# Altium schematic sheet 温湿度.SchDoc
size A2
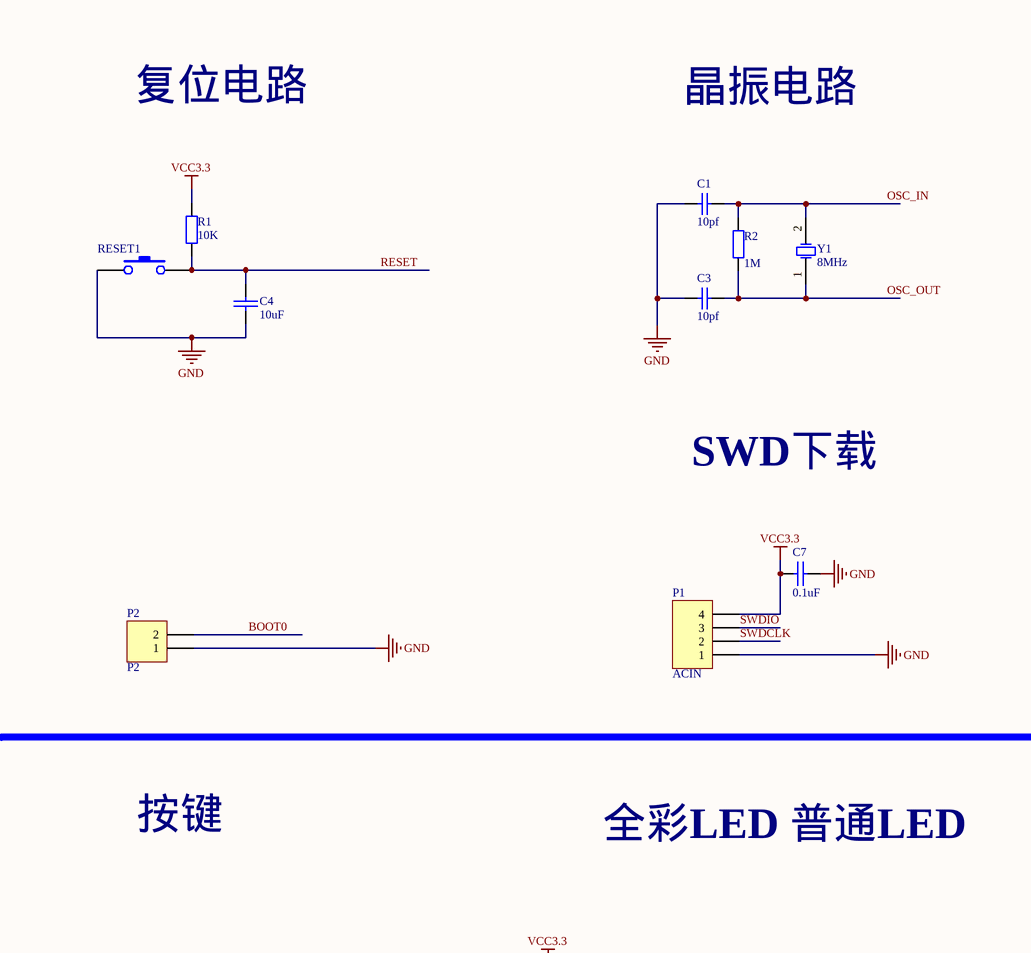
[diagram p0: 温湿度.SchDoc, top left]
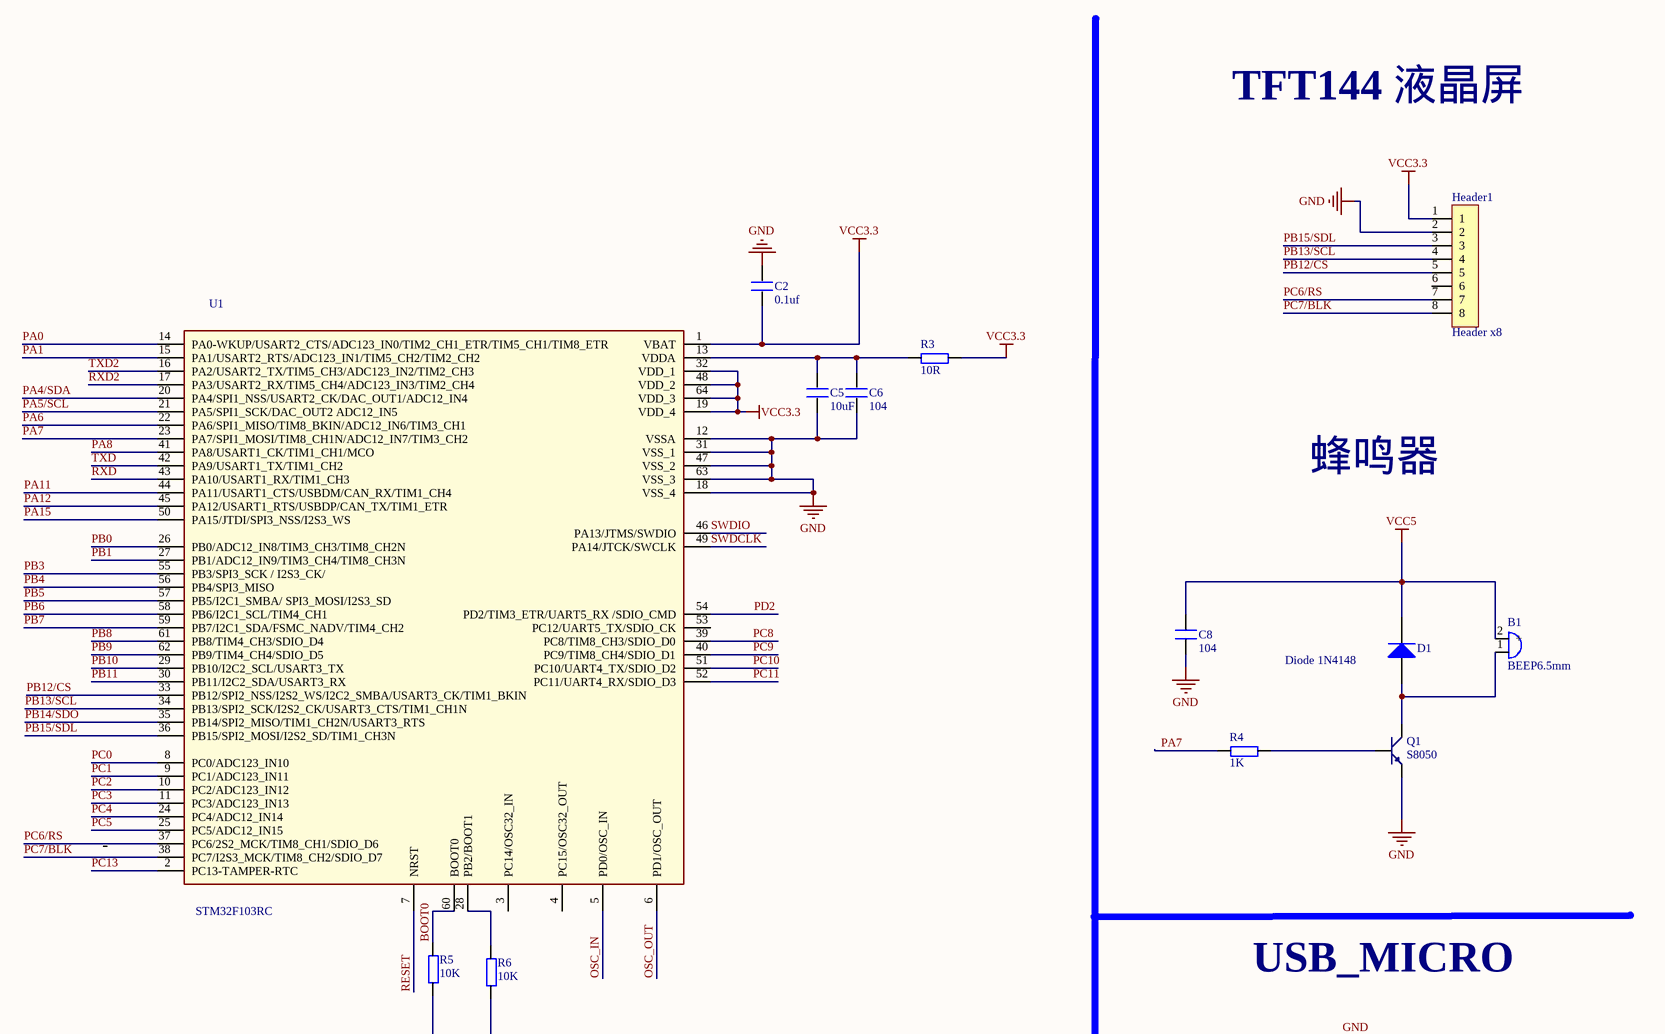
[diagram p1: 温湿度.SchDoc, top right]
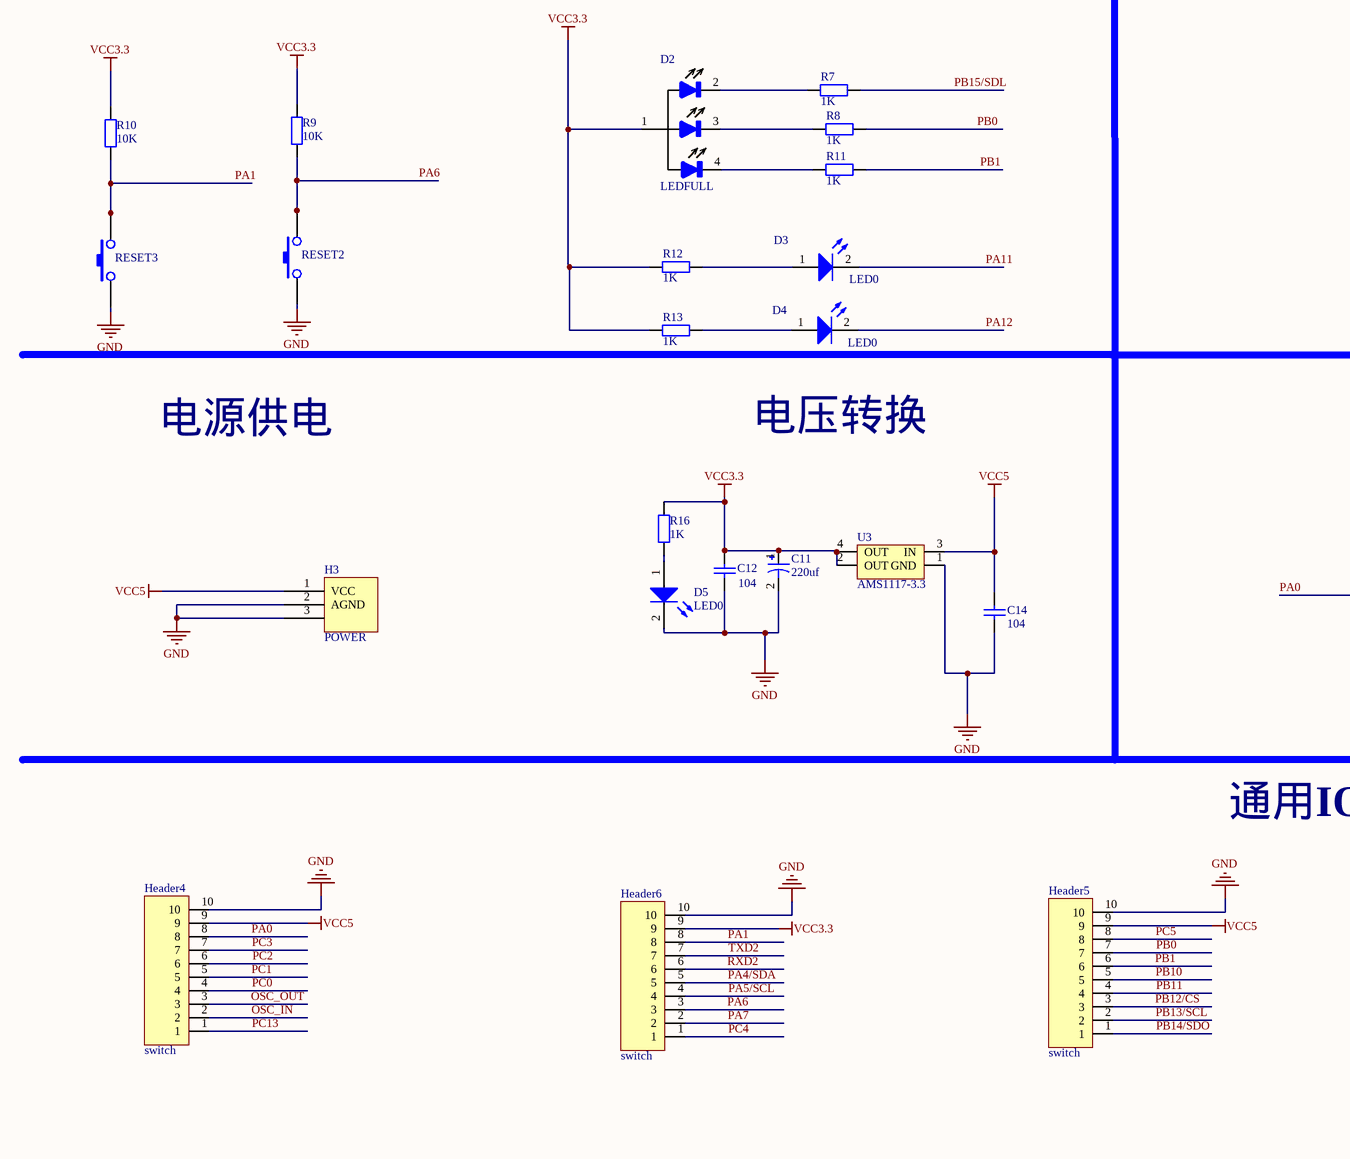
[diagram p2: 温湿度.SchDoc, bottom left]
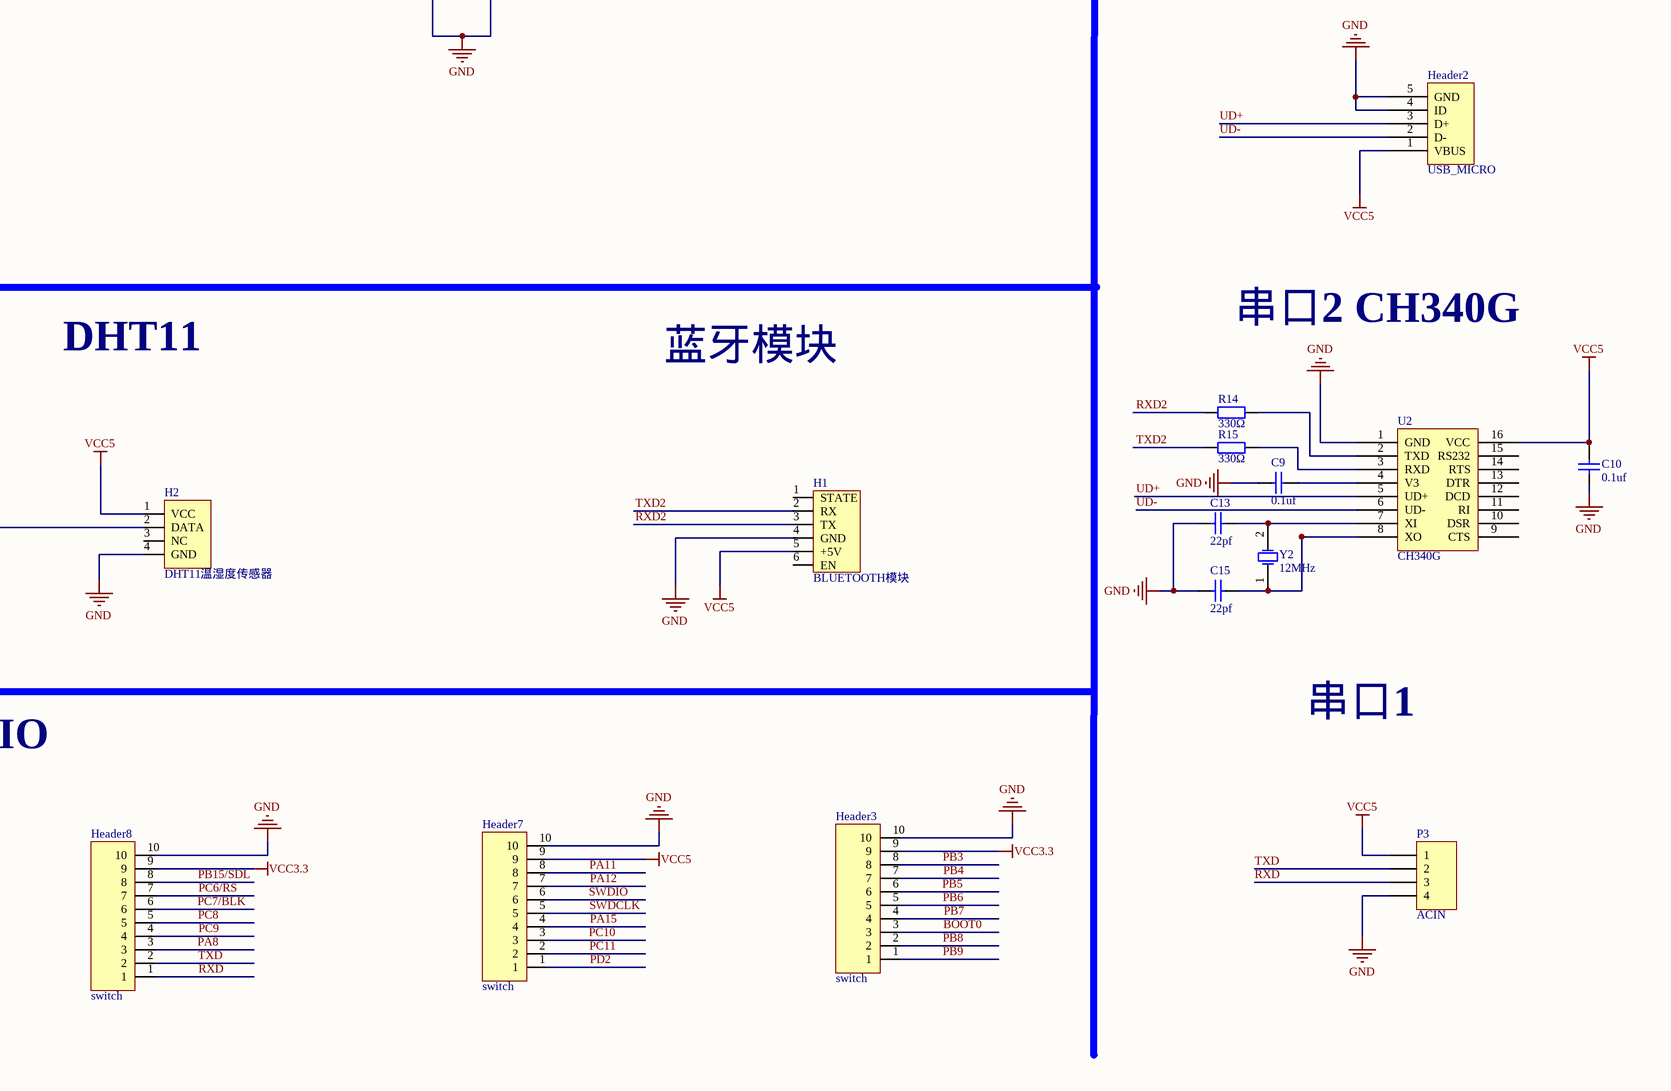
[diagram p3: 温湿度.SchDoc, bottom right]

## Parts
B1  BEEP6.5mm  [BEEP 6.5x12x6]
C1  10pf  [0805C]
C2  0.1uf  [0805C]
C3  10pf  [0805C]
C4  10uF  [0805C]
C5  10uF  [0805C]
C6  104  [0805C]
C7  0.1uF  [0805C]
C8  104  [0805C]
C9  0.1uf  [0805C]
C10  0.1uf  [0805C]
C11  220uf  [HDR2.54-LI-2P]
C12  104  [0805C]
C13  22pf  [0805C]
C14  104  [0805C]
C15  22pf  [0805C]
D1  Diode 1N4148  [0805D]
D2  LEDFULL  [LEDFULL]
D3  LED0  [LED_0805_B]
D4  LED0  [LED_0805_B]
D5  LED0  [LED_0805_B]
H1  BLUETOOTH模块  [BLUETOOTH]
H2  DHT11温湿度传感器  [DHT11]
H3  POWER  [DC-005]
Header1  Header x8  [HDR2.54-M-LI-8P]
Header2  USB_MICRO  [USB/SM0.8-6H5]
Header3  switch  [HDR2.54-LI-10P]
Header4  switch  [HDR2.54-LI-10P]
Header5  switch  [HDR2.54-LI-10P]
Header6  switch  [HDR2.54-LI-10P]
Header7  switch  [HDR2.54-LI-10P]
Header8  switch  [HDR2.54-LI-10P]
P1  ACIN  [HDR2.54-LI-4P]
P2  P2  [HDR2.54-LI-2P]
P3  ACIN  [HDR2.54-LI-4P]
Q1  S8050  [SOT-23R]
R1  10K  [0805R]
R2  value 1M  [0805R]  (hidden comment: Res2)
R3  10R  [0805R]
R4  1K  [0805R]
R5  10K  [0805R]
R6  10K  [0805R]
R7  1K  [0805R]
R8  1K  [0805R]
R9  10K  [0805R]
R10  10K  [0805R]
R11  1K  [0805R]
R12  1K  [0805R]
R13  1K  [0805R]
R14  330Ω  [0805R]
R15  330Ω  [0805R]
R16  1K  [0805R]
RESET1  RESET  [QKEY]  (value not drawn)
RESET2  RESET  [QKEY]  (value not drawn)
RESET3  RESET  [QKEY]  (value not drawn)
U1  STM32F103RC  [LQFP64-高密度]
U2  CH340G  [SOP16]
U3  AMS1117-3.3  [AMS1117]
Y1  8MHz  [OSC HC-49SMD]
Y2  12MHz  [OSC HC-49SMD]

## Nets
GND: C1.1 C2.2 C3.1 C4.2 C5.1 C6.1 C7.2 C8.1 C9.2 C10.1 C11.2 C12.1 C13.2 C14.1 C15.2 D5.2(K) H1.4(GND) H2.4(GND) H3.2(AGND) H3.3 Header1.2 Header2.4(ID) Header2.5(GND) Header3.10 Header4.10 Header5.10 Header6.10 Header7.10 Header8.10 P1.1 P2.1 P3.4 Q1.1(E) R5.1 R6.1 RESET1.1 RESET2.1 RESET3.1 U1.12(VSSA) U1.18(VSS_4) U1.31(VSS_1) U1.47(VSS_2) U1.63(VSS_3) U2.1(GND) U3.1(GND)
VCC3.3: C2.1 C7.1 C11.1 C12.2 D2.1 Header1.1 Header3.9 Header6.9 Header8.9 P1.4 R1.1 R3.2 R9.1 R10.1 R12.1 R13.1 R16.1 U1.1(VBAT) U1.19(VDD_4) U1.32(VDD_1) U1.48(VDD_2) U1.64(VDD_3) U3.2(OUT) U3.4(OUT)
VCC5: B1.2(+) C8.2 C10.2 C14.2 D1.2(K) H1.5(+5V) H2.1(VCC) H3.1(VCC) Header2.1(VBUS) Header4.9 Header5.9 Header7.9 P3.1 U2.16(VCC) U3.3(IN)
BOOT0: Header3.3 P2.2 R5.2 U1.60(BOOT0)
OSC_IN: C1.2 Header4.2 R2.2 U1.5(PD0/OSC_IN) Y1.2(OSC2)
OSC_OUT: C3.2 Header4.3 R2.1 U1.6(PD1/OSC_OUT) Y1.1(OSC1)
PA0: H2.2(DATA) Header4.8 U1.14(PA0-WKUP/USART2_CTS/ADC123_IN0/TIM2_CH1_ETR/TIM5_CH1/TIM8_ETR)
PA1: Header6.8 R10.2 RESET3.2 U1.15(PA1/USART2_RTS/ADC123_IN1/TIM5_CH2/TIM2_CH2)
PA4/SDA: Header6.5 U1.20(PA4/SPI1_NSS/USART2_CK/DAC_OUT1/ADC12_IN4)
PA5/SCL: Header6.4 U1.21(PA5/SPI1_SCK/DAC_OUT2_ADC12_IN5)
PA6: Header6.3 R9.2 RESET2.2 U1.22(PA6/SPI1_MISO/TIM8_BKIN/ADC12_IN6/TIM3_CH1)
PA7: Header6.2 R4.1 U1.23(PA7/SPI1_MOSI/TIM8_CH1N/ADC12_IN7/TIM3_CH2)
PA8: Header8.3 U1.41(PA8/USART1_CK/TIM1_CH1/MCO)
PA11: D3.2(K) Header7.8 U1.44(PA11/USART1_CTS/USBDM/CAN_RX/TIM1_CH4)
PA12: D4.2(K) Header7.7 U1.45(PA12/USART1_RTS/USBDP/CAN_TX/TIM1_ETR)
PA15: Header7.4 U1.50(PA15/JTDI/SPI3_NSS/I2S3_WS)
PB0: Header5.7 R8.2 U1.26(PB0/ADC12_IN8/TIM3_CH3/TIM8_CH2N)
PB1: Header5.6 R11.2 U1.27(PB1/ADC12_IN9/TIM3_CH4/TIM8_CH3N)
PB3: Header3.8 U1.55(PB3/SPI3_SCK_/_I2S3_CK/)
PB4: Header3.7 U1.56(PB4/SPI3_MISO)
PB5: Header3.6 U1.57(PB5/I2C1_SMBA/_SPI3_MOSI/I2S3_SD)
PB6: Header3.5 U1.58(PB6/I2C1_SCL/TIM4_CH1)
PB7: Header3.4 U1.59(PB7/I2C1_SDA/FSMC_NADV/TIM4_CH2)
PB8: Header3.2 U1.61(PB8/TIM4_CH3/SDIO_D4)
PB9: Header3.1 U1.62(PB9/TIM4_CH4/SDIO_D5)
PB10: Header5.5 U1.29(PB10/I2C2_SCL/USART3_TX)
PB11: Header5.4 U1.30(PB11/I2C2_SDA/USART3_RX)
PB12/CS: Header1.5 Header5.3 U1.33(PB12/SPI2_NSS/I2S2_WS/I2C2_SMBA/USART3_CK/TIM1_BKIN)
PB13/SCL: Header1.4 Header5.2 U1.34(PB13/SPI2_SCK/I2S2_CK/USART3_CTS/TIM1_CH1N)
PB14/SDO: Header5.1 U1.35(PB14/SPI2_MISO/TIM1_CH2N/USART3_RTS)
PB15/SDL: Header1.3 Header8.8 R7.2 U1.36(PB15/SPI2_MOSI/I2S2_SD/TIM1_CH3N)
PC0: Header4.4 U1.8(PC0/ADC123_IN10)
PC1: Header4.5 U1.9(PC1/ADC123_IN11)
PC2: Header4.6 U1.10(PC2/ADC123_IN12)
PC3: Header4.7 U1.11(PC3/ADC123_IN13)
PC4: Header6.1 U1.24(PC4/ADC12_IN14)
PC5: Header5.8 U1.25(PC5/ADC12_IN15)
PC6/RS: Header1.7 Header8.7 U1.37(PC6/2S2_MCK/TIM8_CH1/SDIO_D6)
PC7/BLK: Header1.8 Header8.6 U1.38(PC7/I2S3_MCK/TIM8_CH2/SDIO_D7)
PC8: Header8.5 U1.39(PC8/TIM8_CH3/SDIO_D0)
PC9: Header8.4 U1.40(PC9/TIM8_CH4/SDIO_D1)
PC10: Header7.3 U1.51(PC10/UART4_TX/SDIO_D2)
PC11: Header7.2 U1.52(PC11/UART4_RX/SDIO_D3)
PC13: Header4.1 U1.2(PC13-TAMPER-RTC)
PD2: Header7.1 U1.54(PD2/TIM3_ETR/UART5_RX_/SDIO_CMD)
RESET: C4.1 R1.2 RESET1.2 U1.7(NRST)
RXD: Header8.1 P3.3 U1.43(PA10/USART1_RX/TIM1_CH3)
RXD2: H1.3(TX) Header6.6 R14.1 U1.17(PA3/USART2_RX/TIM5_CH4/ADC123_IN3/TIM2_CH4)
SWDCLK: Header7.5 P1.2 U1.49(PA14/JTCK/SWCLK)
SWDIO: Header7.6 P1.3 U1.46(PA13/JTMS/SWDIO)
TXD: Header8.2 P3.2 U1.42(PA9/USART1_TX/TIM1_CH2)
TXD2: H1.2(RX) Header6.7 R15.1 U1.16(PA2/USART2_TX/TIM5_CH3/ADC123_IN2/TIM2_CH3)
UD+: Header2.3(D+) U2.5(UD+)
UD-: Header2.2(D-) U2.6(UD-)
NetB1_1: B1.1 D1.1(A) Q1.3(C)
NetC5_2: C5.2 C6.2 R3.1 U1.13(VDDA)
NetC9_1: C9.1 U2.4(V3)
NetC13_1: C13.1 U2.7(XI) Y2.2(OSC2)
NetC15_1: C15.1 U2.8(XO) Y2.1(OSC1)
NetD2_2: D2.2 R7.1
NetD2_3: D2.3 R8.1
NetD2_4: D2.4 R11.1
NetD3_1: D3.1(A) R12.2
NetD4_1: D4.1(A) R13.2
NetD5_1: D5.1(A) R16.2
NetQ1_2: Q1.2(B) R4.2
NetR6_2: R6.2 U1.28(PB2/BOOT1)
NetR14_2: R14.2 U2.2(TXD)
NetR15_2: R15.2 U2.3(RXD)

Not connected (* = marked no-connect by the designer): H1 1(STATE) 6(EN); H2 3(NC); Header1 6; U1 3(PC14/OSC32_IN) 4(PC15/OSC32_OUT) 53(PC12/UART5_TX/SDIO_CK); U2 9(CTS) 10(DSR) 11(RI) 12(DCD) 13(DTR) 14(RTS) 15(RS232)

## Notes on the sheet
- 复位电路
- 晶振电路
- TFT144 液晶屏
- SWD下载
- 蜂鸣器
- 按键
- 全彩LED 普通LED
- USB_MICRO
- 电源供电
- 电压转换
- DHT11
- 蓝牙模块
- 串口2 CH340G
- 通用IO
- 串口1

## Library data of the parts
B1 = BEEP
C1 C3 C9 C10 C12 C14 = Cap: Capacitor; Published: 8-Jun-2000; LatestRevisionDate: 17-Jul-2002; LatestRevisionNote: Re-released for DXP Platform.; PackageReference: RAD-0.3; Publisher: Altium Limited
  C1 C3: Value: 10pF
  C9 C10: PackageDescription: Radial Cap, Thru-Hole; 2 Leads; 0.3 in Pin Spacing; Value: 0.1uf
  C12 C14: PackageDescription: Radial Cap, Thru-Hole; 2 Leads; 0.3 in Pin Spacing; Value: 104
C2 C6 C8 = C
C4 C7 = CAP: Capacitor
C5 = C_2
C11 = Cap Pol3: Polarized Capacitor (Surface Mount); Published: 8-Jun-2000; LatestRevisionDate: 29-May-2009; LatestRevisionNote: IPC-7351 Footprint Added.; PackageReference: C0805; Publisher: Altium Limited; PackageDescription: Chip Capacitor; Value: 220uf
C13 C15 = Cap: Capacitor; Value: 0.1uf; Published: 8-Jun-2000; LatestRevisionDate: 17-Jul-2002; LatestRevisionNote: Re-released for DXP Platform.; PackageReference: RAD-0.3; Publisher: Altium Limited; PackageDescription: Radial Cap, Thru-Hole; 2 Leads; 0.3 in Pin Spacing
D1 = Diode 1N4148: High Conductance Fast Diode; Published: 8-Jun-2000; LatestRevisionDate: 17-Jul-2002; LatestRevisionNote: Re-released for DXP Platform.; DatasheetVersion: 1997; PackageReference: DO-35; Publisher: Altium Limited; PackageDescription: Diode, Axial; Body 3.8 x 1.9 mm (LxDia. max), Lead Dia. 0.53 mm (max); Code_JEDEC: DO-204-AH; ComponentLink1Description: Manufacturer Link; ComponentLink1URL: http://www.fairchildsemi.com/; ComponentLink2Description: Datasheet; ComponentLink2URL: http://www.fairchildsemi.com/ds/1N%2F1N4148.pdf
D2 = LEDFULL: 全彩LED
D3-D5 = LED0: Typical INFRARED GaAs LED; Published: 8-Jun-2000; LatestRevisionDate: 08-Jul-2005; LatestRevisionNote: Mech Layer 1 removed.; PackageReference: LED-0; Publisher: Altium Limited; PackageDescription: LED; 2 Leads
H1 = BLUETOOTH
H2 = DHT11
H3 = DC_IN
Header1 = Header x8: 红外2个 4VCC 4GND 2信号线
Header3-Header8 = Header X10
P1 P3 = P4: Header, 4-Pin; LatestRevisionDate: 17-Jul-2002; LatestRevisionNote: Re-released for DXP Platform.; Publisher: Altium Limited
P2 = P2: Header, 2-Pin; LatestRevisionDate: 17-Jul-2002; LatestRevisionNote: Re-released for DXP Platform.; Publisher: Altium Limited
Q1 = NPN: 8050/BCW846/BCW847
R1 R7-R16 = Res2: Resistor; Manufacturer: Generic Components; Class: Passive; Value: 330; Published: 08/06/2000; Publisher: Altium Hobart Technology Centre; SubClass: Resistor
R2 = Res2: Resistor; Published: 8-Jun-2000; LatestRevisionDate: 17-Jul-2002; LatestRevisionNote: Re-released for DXP Platform.; PackageReference: AXIAL-0.4; Publisher: Altium Limited
R3 R4 = R_1
R5 R6 = R
RESET1-RESET3 = SW-PB
Y1 Y2 = XTAL: Crystal Oscillator; Published: 8-Jun-2000; LatestRevisionDate: 17-Jul-2002; LatestRevisionNote: Re-released for DXP Platform.; Publisher: Altium Limited
U1 = STM32F103RC: 型号: *; Part Number: *; 备注: *